# Altium schematic sheet 3.phy1.SchDoc
size A3; Organization: Altium Limited; Address1: L3, 12a Rodborough Rd; Address2: Frenchs Forest; Address3: NSW; Address4: Australia 2086; SheetNumber: 3; SheetTotal: 4
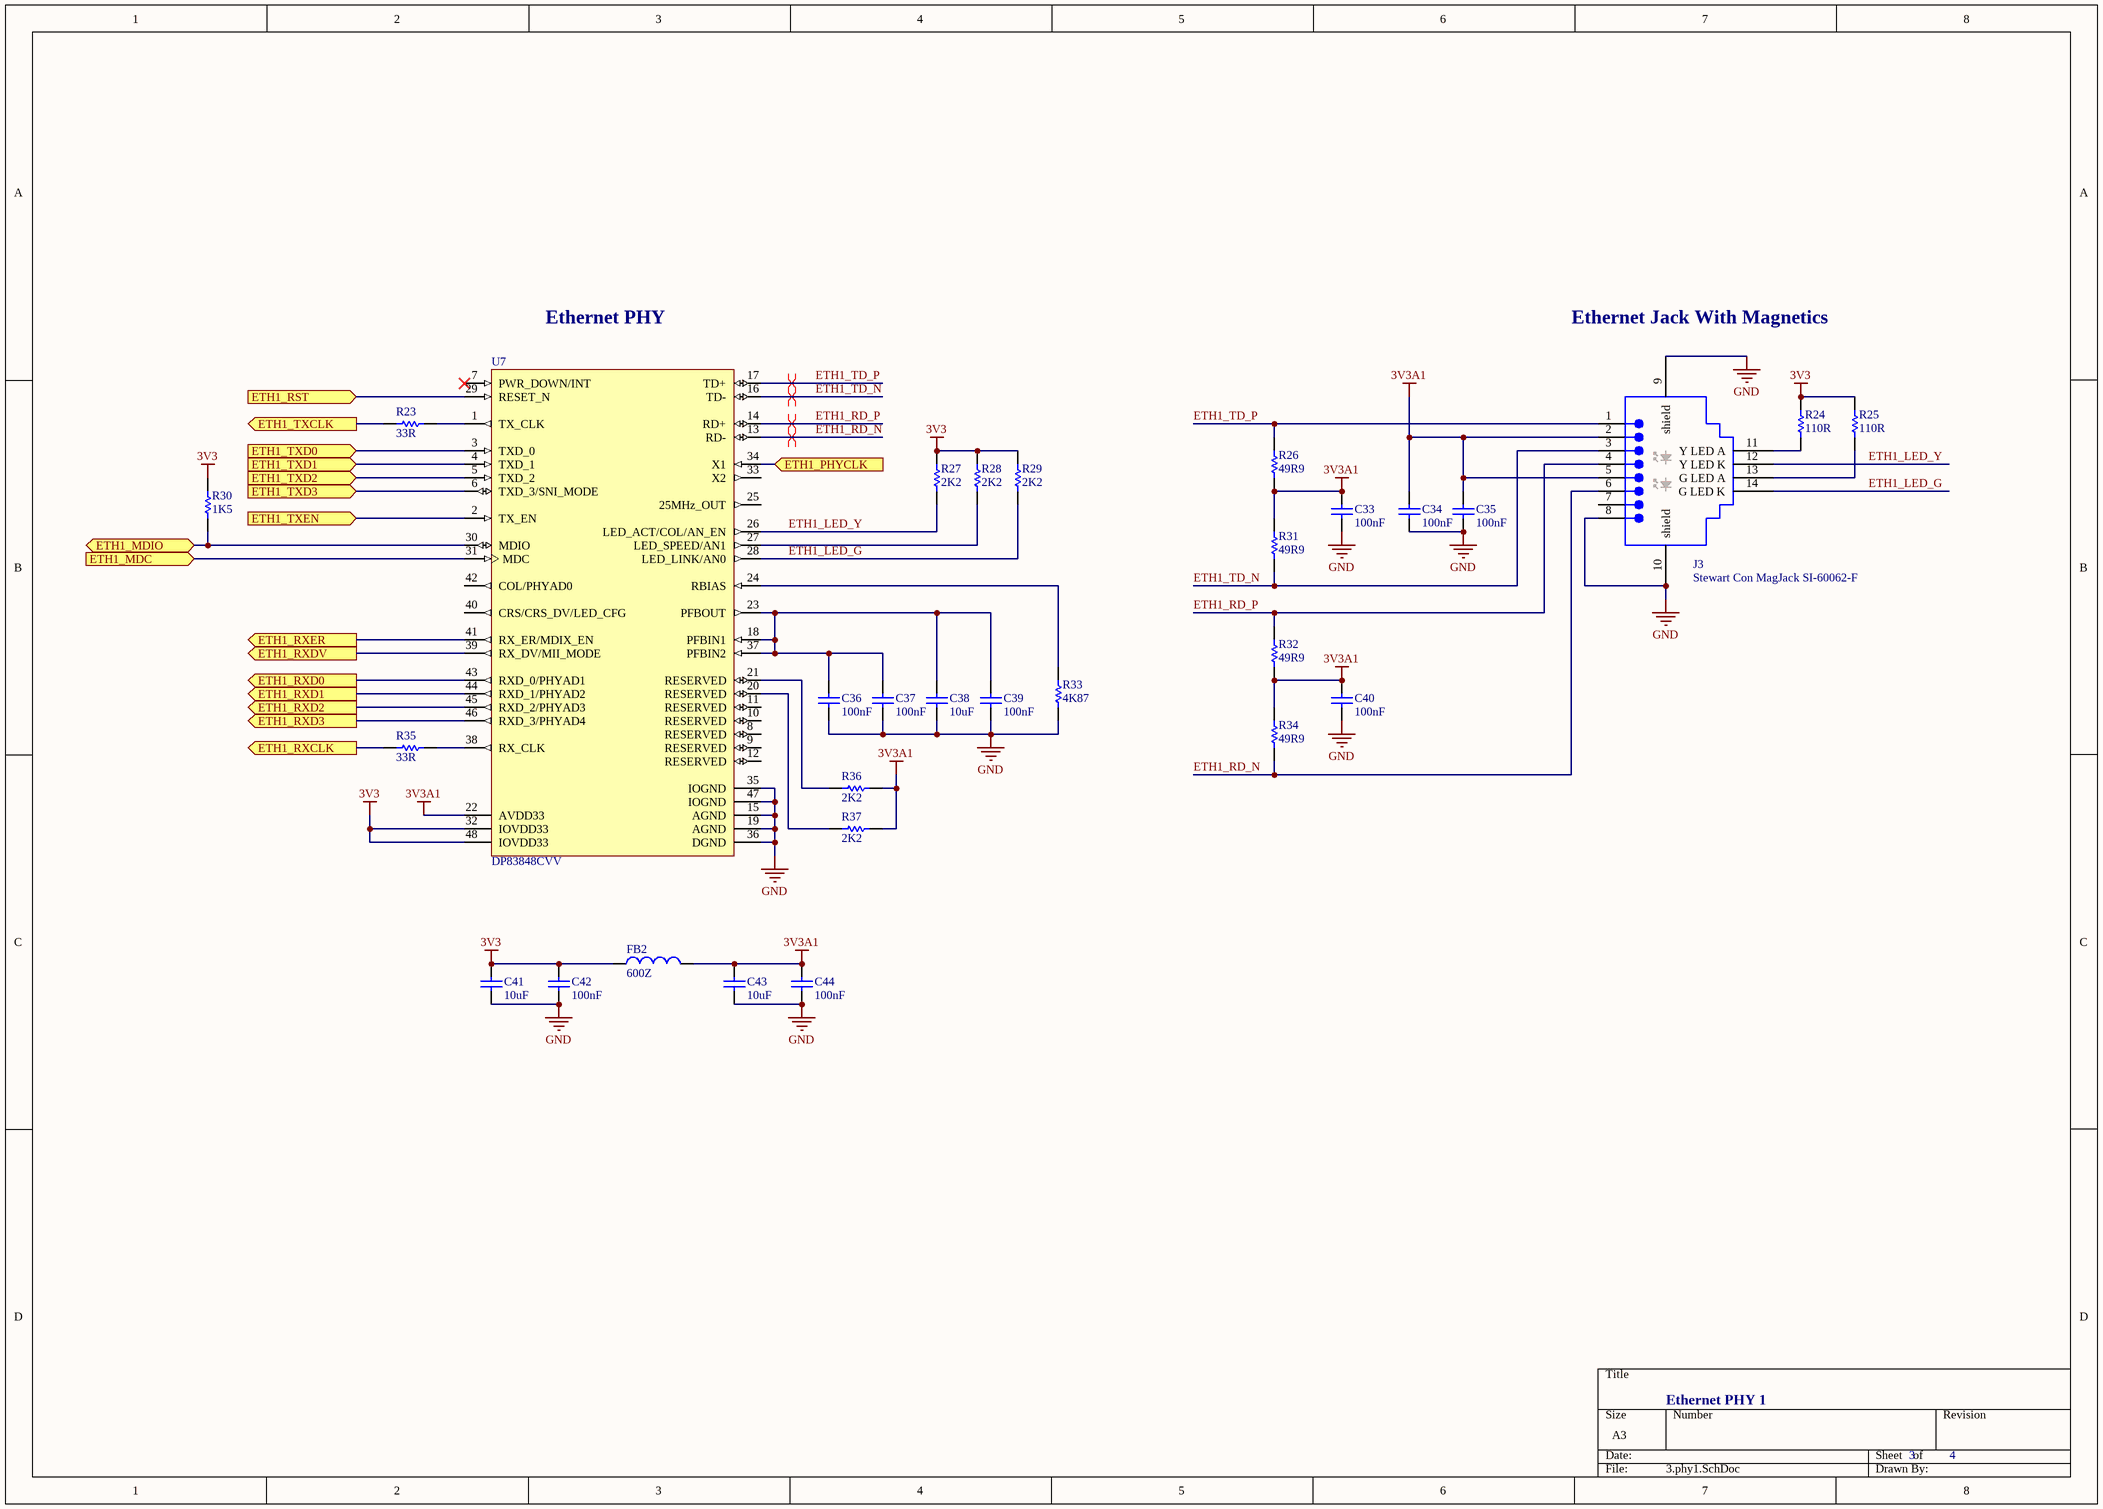
[diagram p0: 3.phy1.SchDoc]

## Parts
C33  value 100nF  [1005[0402]_CAP2]  (hidden comment: Cap)
C34  value 100nF  [1005[0402]_CAP2]  (hidden comment: Cap)
C35  value 100nF  [1005[0402]_CAP2]  (hidden comment: Cap)
C36  value 100nF  [1005[0402]_CAP2]  (hidden comment: Cap)
C37  value 100nF  [1005[0402]_CAP2]  (hidden comment: Cap)
C38  value 10uF  [1608[0603]_CAP2]  (hidden comment: Cap)
C39  value 100nF  [1005[0402]_CAP2]  (hidden comment: Cap)
C40  value 100nF  [1005[0402]_CAP2]  (hidden comment: Cap)
C41  value 10uF  [1608[0603]_CAP2]  (hidden comment: Cap)
C42  value 100nF  [1005[0402]_CAP2]  (hidden comment: Cap)
C43  value 10uF  [1608[0603]_CAP2]  (hidden comment: Cap)
C44  value 100nF  [1005[0402]_CAP2]  (hidden comment: Cap)
FB2  value 600Z  [1005[0402]_FB2]  (hidden comment: Ferrite Bead)
J3  Stewart Con MagJack SI-60062-F  [Steward Con RJ45]
R23  value 33R  [1005[0402]_RES2]  (hidden comment: Res)
R24  value 110R  [1005[0402]_RES2]  (hidden comment: Res)
R25  value 110R  [1005[0402]_RES2]  (hidden comment: Res)
R26  value 49R9  [1005[0402]_RES2]  (hidden comment: Res)
R27  value 2K2  [1005[0402]_RES2]  (hidden comment: Res)
R28  value 2K2  [1005[0402]_RES2]  (hidden comment: Res)
R29  value 2K2  [1005[0402]_RES2]  (hidden comment: Res)
R30  value 1K5  [1005[0402]_RES2]  (hidden comment: Res)
R31  value 49R9  [1005[0402]_RES2]  (hidden comment: Res)
R32  value 49R9  [1005[0402]_RES2]  (hidden comment: Res)
R33  value 4K87  [1005[0402]_RES2]  (hidden comment: Res)
R34  value 49R9  [1005[0402]_RES2]  (hidden comment: Res)
R35  value 33R  [1005[0402]_RES2]  (hidden comment: Res)
R36  value 2K2  [1005[0402]_RES2]  (hidden comment: Res)
R37  value 2K2  [1005[0402]_RES2]  (hidden comment: Res)
U7  DP83848CVV  [TSQFP50P900X900-48M]

## Ports
ETH1_MDC (in), ETH1_MDIO (bidir), ETH1_PHYCLK (in), ETH1_RST (in), ETH1_RXCLK (out), ETH1_RXD0 (out), ETH1_RXD1 (out), ETH1_RXD2 (out), ETH1_RXD3 (out), ETH1_RXDV (out), ETH1_RXER (out), ETH1_TXCLK (out), ETH1_TXD0 (in), ETH1_TXD1 (in), ETH1_TXD2 (in), ETH1_TXD3 (in), ETH1_TXEN (in)

## Nets
3V3: C41.2 C42.2 FB2.1 R24.2 R25.2 R27.2 R28.2 R29.2 R30.2 U7.32(IOVDD33) U7.48(IOVDD33)
3V3A1: C33.2 C34.2 C35.2 C40.2 C43.2 C44.2 FB2.2 J3.2 J3.5 R26.1 R31.2 R32.1 R34.2 R36.1 R37.1 U7.22(AVDD33)
GND: C33.1 C34.1 C35.1 C36.1 C37.1 C38.1 C39.1 C40.1 C41.1 C42.1 C43.1 C44.1 J3.8 J3.9(shield) J3.10(shield) R33.1 U7.15(AGND) U7.19(AGND) U7.35(IOGND) U7.36(DGND) U7.47(IOGND)
ETH1_LED_G: J3.14(G_LED_K) R29.1 U7.28(LED_LINK/AN0)
ETH1_LED_Y: J3.12(Y_LED_K) R27.1 U7.26(LED_ACT/COL/AN_EN)
ETH1_MDC: U7.31(MDC) ; port ETH1_MDC
ETH1_MDIO: R30.1 U7.30(MDIO) ; port ETH1_MDIO
ETH1_PHYCLK: U7.34(X1) ; port ETH1_PHYCLK
ETH1_RD_N: J3.6 R34.1 U7.13(RD-)
ETH1_RD_P: J3.4 R32.2 U7.14(RD+)
ETH1_RST: U7.29(RESET_N) ; port ETH1_RST
ETH1_RXCLK: R35.1 ; port ETH1_RXCLK
ETH1_RXD0: U7.43(RXD_0/PHYAD1) ; port ETH1_RXD0
ETH1_RXD1: U7.44(RXD_1/PHYAD2) ; port ETH1_RXD1
ETH1_RXD2: U7.45(RXD_2/PHYAD3) ; port ETH1_RXD2
ETH1_RXD3: U7.46(RXD_3/PHYAD4) ; port ETH1_RXD3
ETH1_RXDV: U7.39(RX_DV/MII_MODE) ; port ETH1_RXDV
ETH1_RXER: U7.41(RX_ER/MDIX_EN) ; port ETH1_RXER
ETH1_TD_N: J3.3 R31.1 U7.16(TD-)
ETH1_TD_P: J3.1 R26.2 U7.17(TD+)
ETH1_TXCLK: R23.1 ; port ETH1_TXCLK
ETH1_TXD0: U7.3(TXD_0) ; port ETH1_TXD0
ETH1_TXD1: U7.4(TXD_1) ; port ETH1_TXD1
ETH1_TXD2: U7.5(TXD_2) ; port ETH1_TXD2
ETH1_TXD3: U7.6(TXD_3/SNI_MODE) ; port ETH1_TXD3
ETH1_TXEN: U7.2(TX_EN) ; port ETH1_TXEN
NetC36_2: C36.2 C37.2 C38.2 C39.2 U7.18(PFBIN1) U7.23(PFBOUT) U7.37(PFBIN2)
NetJ3_11: J3.11(Y_LED_A) R24.1
NetJ3_13: J3.13(G_LED_A) R25.1
NetR23_2: R23.2 U7.1(TX_CLK)
NetR28_1: R28.1 U7.27(LED_SPEED/AN1)
NetR33_2: R33.2 U7.24(RBIAS)
NetR35_2: R35.2 U7.38(RX_CLK)
NetR36_2: R36.2 U7.21(RESERVED)
NetR37_2: R37.2 U7.20(RESERVED)

Not connected (* = marked no-connect by the designer): J3 7; U7 7(PWR_DOWN/INT)* 8(RESERVED) 9(RESERVED) 10(RESERVED) 11(RESERVED) 12(RESERVED) 25(25MHz_OUT) 33(X2) 40(CRS/CRS_DV/LED_CFG) 42(COL/PHYAD0)

## Layout directives
differential pair: ETH1_RD_N, ETH1_RD_P, ETH1_TD_N, ETH1_TD_P

## Notes on the sheet
- Ethernet PHY
- Ethernet Jack With Magnetics
- Ethernet PHY 1
- Title
- Size:
- Date:
- A3
- Number:
- Time:
- Revision:
- Sheet
- of
- File:

## Library data of the parts
C33-C37 C39 C40 C42 C44 = Cap: Capacitor; Manufacturer: SAMSUNG; ProductCode: CL05B104KO5NNNC; Vendor: Digikey; VendorCode: 1276-1001-1-ND; Published: 8-Jun-2000; LatestRevisionDate: 17-Jul-2002; LatestRevisionNote: Re-released for DXP Platform.; PackageReference: RAD-0.3; Publisher: Altium Limited; Price: 0,01
C38 C41 C43 = Cap: Capacitor; Manufacturer: SAMSUNG; VendorCode: 1276-6775-1-ND; Vendor: Digikey; ProductCode: CL10A106MPNNHBC; Published: 8-Jun-2000; LatestRevisionDate: 17-Jul-2002; LatestRevisionNote: Re-released for DXP Platform.; PackageReference: RAD-0.3; Publisher: Altium Limited; Price: 0,22
FB2 = Ferrite Bead: Manufacturer: MURATA; Code_IEC: 1005; ProductCode: BLM15AX601SN1D; Vendor: Digikey; VendorCode: 490-5441-1-ND; Published: 8-Jun-2000; LatestRevisionDate: 29-May-2009; LatestRevisionNote: IPC-7351 Footprint Added.; PackageReference: 0402-A; Publisher: Altium Limited; PackageDescription: Chip Inductor; Code_JEITA: 0402; Price: 0,11
J3 = Steward con RJ45 with magnetics: Right Angle,RJ45-Keyed, Flange Mount PCB Jack; Manufacturer: STEWART CONNECTOR; Ports: 1; Positions/Loaded: Port1 - 8 Keyed/8; PerformanceCategory: 3; PCB_Mounting: Thru-Hole; ComponentAvailability: Obsolete; DrillSize: Nominal, Rounded to nearest 0.05mm; PCB_Layout: Complies with Manufacturer's Recommendation.; Vendor: Digikey; VendorCode: 380-1106-ND; Published: 25-Jun-2002; DatasheetDocument: 18-Dec-2001; PackageDocument: 18-Dec-2001; PackageReference: 15-43-6233; Publisher: Altium Limited; ComponentLink1Description: Manufacturer Link; ComponentLink1URL: http://www.molex.com/; ComponentLink2Description: Datasheet; ComponentLink2URL: http://www.molex.com/cmc_upload/common_files/1212003_catalogmx41314.pdf; ComponentLink3Description: Iges Model; ComponentLink3URL: http://www.molex.com/pdm_docs/igs/15-43-6233_igs.zip; ProductCode: SI-60062-F; Price: 4,07
R23 R35 = Res: Resistor; Manufacturer: PANASONIC; Vendor: Digikey; VendorCode: P33JCT-ND; ProductCode: ERJ-2GEJ330X; Published: 8-Jun-2000; LatestRevisionDate: 17-Jul-2002; LatestRevisionNote: Re-released for DXP Platform.; PackageReference: AXIAL-0.3; Publisher: Altium Limited; Price: 0,02
R24 R25 = Res: Resistor; Manufacturer: PANASONIC; ProductCode: ERJ-2GEJ111X; VendorCode: P110JCT-ND; Vendor: Digikey; Published: 8-Jun-2000; LatestRevisionDate: 17-Jul-2002; LatestRevisionNote: Re-released for DXP Platform.; PackageReference: AXIAL-0.3; Publisher: Altium Limited; Price: 0,02
R26 R31 R32 R34 = Res: Resistor; Manufacturer: PANASONIC; ProductCode: ERJ-2RKF49R9X; VendorCode: P49.9LCT-ND; Vendor: Digikey; Published: 8-Jun-2000; LatestRevisionDate: 17-Jul-2002; LatestRevisionNote: Re-released for DXP Platform.; PackageReference: AXIAL-0.3; Publisher: Altium Limited; Price: 0,02
R27-R29 R36 R37 = Res: Resistor; Manufacturer: PANASONIC; Vendor: Digikey; VendorCode: P2.20KLCT-ND; ProductCode: ERJ-2RKF2201X; Published: 8-Jun-2000; LatestRevisionDate: 17-Jul-2002; LatestRevisionNote: Re-released for DXP Platform.; PackageReference: AXIAL-0.3; Publisher: Altium Limited; Price: 0,02
R30 = Res: Resistor; Manufacturer: PANASONIC; ProductCode: ERJ-2RKF1501X; VendorCode: P1.50KLCT-ND; Vendor: Digikey; Published: 8-Jun-2000; LatestRevisionDate: 17-Jul-2002; LatestRevisionNote: Re-released for DXP Platform.; PackageReference: AXIAL-0.3; Publisher: Altium Limited; Price: 0,09
R33 = Res: Resistor; Manufacturer: PANASONIC; ProductCode: ERJ-2RKF4871X; VendorCode: P4.87KLCT-ND; Vendor: Digikey; Published: 8-Jun-2000; LatestRevisionDate: 17-Jul-2002; LatestRevisionNote: Re-released for DXP Platform.; PackageReference: AXIAL-0.3; Publisher: Altium Limited; Price: 0,02
U7 = DP83848CVV: PHYTER® Commercial Temperature Single Port 10/100 Mb/s Ethernet Physical Layer Transceiver, 48-pin LQFP; Manufacturer: TEXAS INSTRUMENTS; PackageTopMarking: NSUZXYTT*DP83848VV*VBC; PowerWise: N; CompType: Interface IC; ProductCode: DP83848CVVX/NOPB; VendorCode: DP83848CVVX/NOPBCT-ND; Vendor: Digikey; Published: 4-Dec-2008; DatasheetVersion: May-2008; PackageVersion: revE, May-2007; PackageReference: VBH48A; Publisher: Altium Limited; PackageDescription: LQFP, 7 x 7 x 1.4mm, 48 Lead, 0.5mm Pitch; Supplier 1: Farnell; Supplier Part Number 1: 1286816; Supplier 2: Farnell; Supplier Part Number 2: 1528379; PartNumber: DP83848CVV; RoHS: Y; PinCount: 48; ComponentLink1Description: DP83848C Datasheet; ComponentLink1URL: http://www.national.com/ds/DP/DP83848C.pdf; ComponentLink2Description: DP83848C Web Page; ComponentLink2URL: http://www.national.com/pf/DP/DP83848C.html; ComponentLink3Description: VBH48A Package Page; ComponentLink3URL: http://www.national.com/packaging/folders/vbh48a.html; Price: 4,94